# EAGLE design DR_EIB-128_Circle_0_25MM (EAGLE 9.1.1)
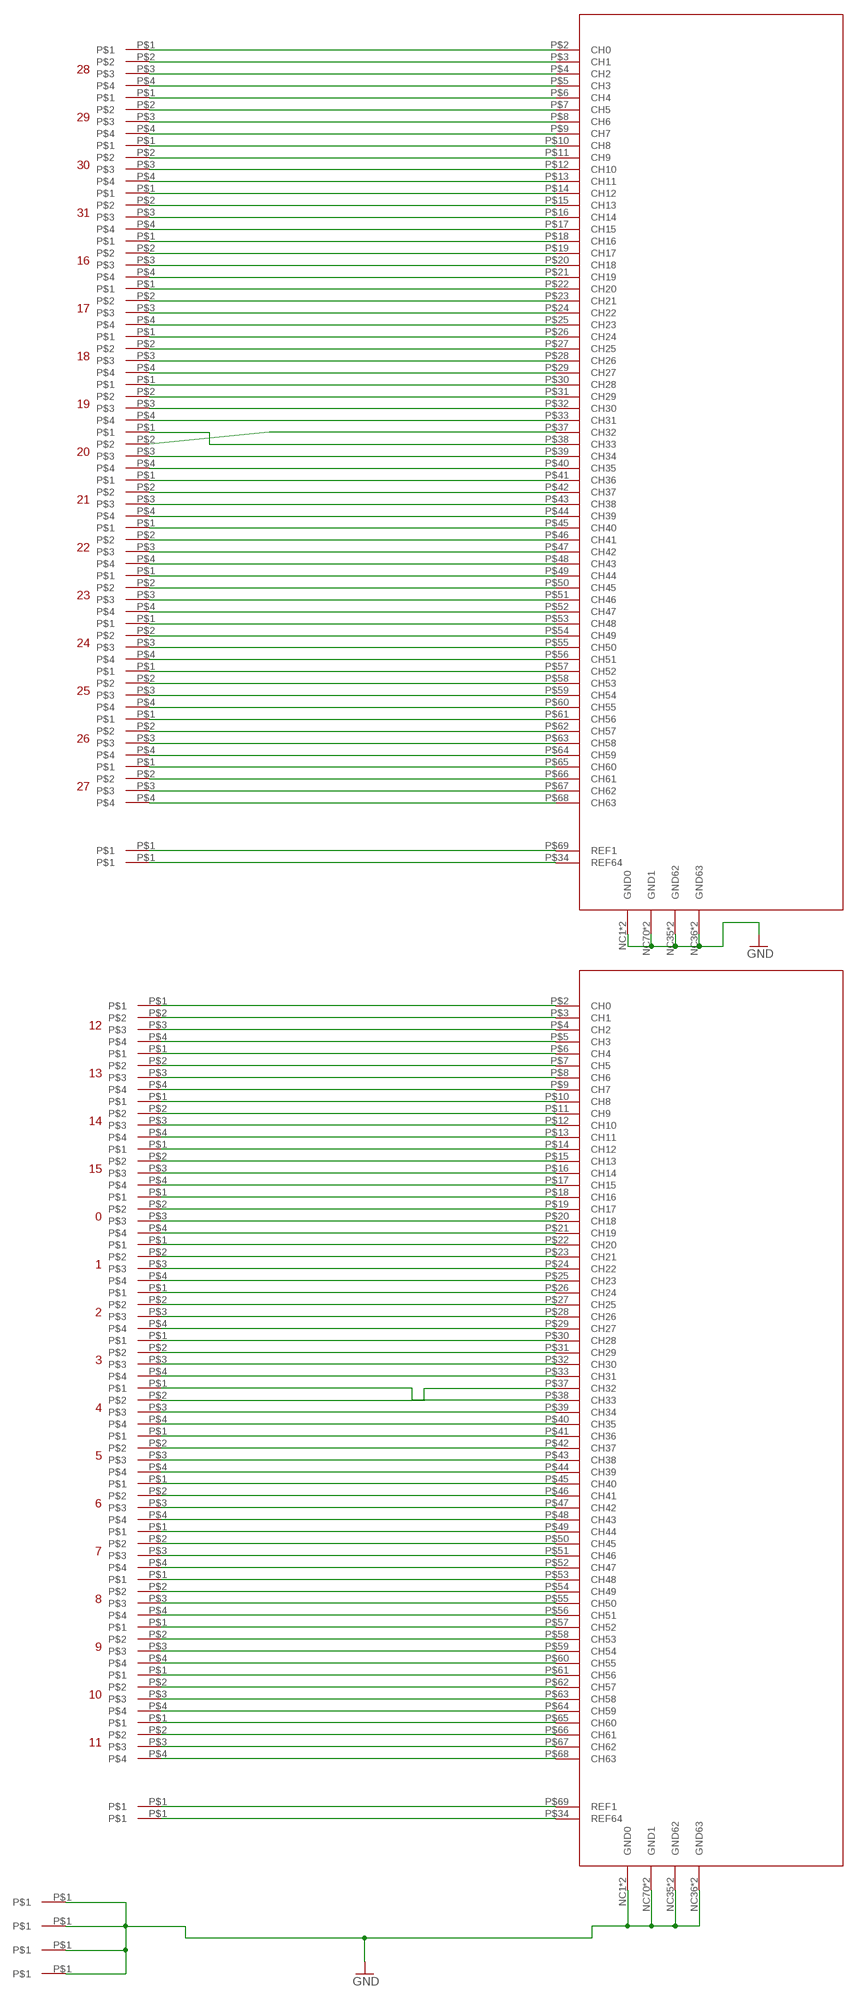
[diagram p0: schematic, sheet 1]

## Parts
0  TETRODE_1.5IN_RADIUS0.25MM  [TETRODE_1.5IN_RADIUS_0.25MM]
1  TETRODE_1.5IN_RADIUS0.25MM  [TETRODE_1.5IN_RADIUS_0.25MM]
2  TETRODE_1.5IN_RADIUS0.25MM  [TETRODE_1.5IN_RADIUS_0.25MM]
3  TETRODE_1.5IN_RADIUS0.25MM  [TETRODE_1.5IN_RADIUS_0.25MM]
4  TETRODE_1.5IN_RADIUS0.25MM  [TETRODE_1.5IN_RADIUS_0.25MM]
5  TETRODE_1.5IN_RADIUS0.25MM  [TETRODE_1.5IN_RADIUS_0.25MM]
6  TETRODE_1.5IN_RADIUS0.25MM  [TETRODE_1.5IN_RADIUS_0.25MM]
7  TETRODE_1.5IN_RADIUS0.25MM  [TETRODE_1.5IN_RADIUS_0.25MM]
8  TETRODE_1.5IN_RADIUS0.25MM  [TETRODE_1.5IN_RADIUS_0.25MM]
9  TETRODE_1.5IN_RADIUS0.25MM  [TETRODE_1.5IN_RADIUS_0.25MM]
10  TETRODE_1.5IN_RADIUS0.25MM  [TETRODE_1.5IN_RADIUS_0.25MM]
11  TETRODE_1.5IN_RADIUS0.25MM  [TETRODE_1.5IN_RADIUS_0.25MM]
12  TETRODE_1.5IN_RADIUS0.25MM  [TETRODE_1.5IN_RADIUS_0.25MM]
13  TETRODE_1.5IN_RADIUS0.25MM  [TETRODE_1.5IN_RADIUS_0.25MM]
14  TETRODE_1.5IN_RADIUS0.25MM  [TETRODE_1.5IN_RADIUS_0.25MM]
15  TETRODE_1.5IN_RADIUS0.25MM  [TETRODE_1.5IN_RADIUS_0.25MM]
16  TETRODE_1.5IN_RADIUS0.25MM  [TETRODE_1.5IN_RADIUS_0.25MM]
17  TETRODE_1.5IN_RADIUS0.25MM  [TETRODE_1.5IN_RADIUS_0.25MM]
18  TETRODE_1.5IN_RADIUS0.25MM  [TETRODE_1.5IN_RADIUS_0.25MM]
19  TETRODE_1.5IN_RADIUS0.25MM  [TETRODE_1.5IN_RADIUS_0.25MM]
20  TETRODE_1.5IN_RADIUS0.25MM  [TETRODE_1.5IN_RADIUS_0.25MM]
21  TETRODE_1.5IN_RADIUS0.25MM  [TETRODE_1.5IN_RADIUS_0.25MM]
22  TETRODE_1.5IN_RADIUS0.25MM  [TETRODE_1.5IN_RADIUS_0.25MM]
23  TETRODE_1.5IN_RADIUS0.25MM  [TETRODE_1.5IN_RADIUS_0.25MM]
24  TETRODE_1.5IN_RADIUS0.25MM  [TETRODE_1.5IN_RADIUS_0.25MM]
25  TETRODE_1.5IN_RADIUS0.25MM  [TETRODE_1.5IN_RADIUS_0.25MM]
26  TETRODE_1.5IN_RADIUS0.25MM  [TETRODE_1.5IN_RADIUS_0.25MM]
27  TETRODE_1.5IN_RADIUS0.25MM  [TETRODE_1.5IN_RADIUS_0.25MM]
28  TETRODE_1.5IN_RADIUS0.25MM  [TETRODE_1.5IN_RADIUS_0.25MM]
29  TETRODE_1.5IN_RADIUS0.25MM  [TETRODE_1.5IN_RADIUS_0.25MM]
30  TETRODE_1.5IN_RADIUS0.25MM  [TETRODE_1.5IN_RADIUS_0.25MM]
31  TETRODE_1.5IN_RADIUS0.25MM  [TETRODE_1.5IN_RADIUS_0.25MM]
U$1  TARRAYSHUTTLEHOLE  [TARRAYSHUTTLEHOLE]
U$2  TARRAYSHUTTLEHOLE  [TARRAYSHUTTLEHOLE]
U$4  TARRAYSHUTTLEHOLE  [TARRAYSHUTTLEHOLE]
U$5  TARRAYSHUTTLEHOLE  [TARRAYSHUTTLEHOLE]
U$6  TARRAYSHUTTLEHOLE  [TARRAYSHUTTLEHOLE]
U$7  TARRAYSHUTTLEHOLE  [TARRAYSHUTTLEHOLE]
U$8  TARRAYSHUTTLEHOLE  [TARRAYSHUTTLEHOLE]
U$9  TARRAYSHUTTLEHOLE  [TARRAYSHUTTLEHOLE]
U$10  HIROSE-70PIN-HEADER-SEQUENTIAL  [DF40C-70DP-0.4V]
U$11  HIROSE-70PIN-HEADER-SEQUENTIAL  [DF40C-70DP-0.4V]

## Nets
GND: U$1.P$1 U$2.P$1 U$4.P$1 U$5.P$1 U$10.NC1(GND0) U$10.NC35(GND62) U$10.NC36(GND63) U$10.NC70(GND1) U$10.P$1(GND0) U$10.P$35(GND62) U$10.P$36(GND63) U$10.P$70(GND1) U$11.NC1(GND0) U$11.NC35(GND62) U$11.NC36(GND63) U$11.NC70(GND1) U$11.P$1(GND0) U$11.P$35(GND62) U$11.P$36(GND63) U$11.P$70(GND1)
N$1: U$9.P$1 U$11.P$69(REF1)
N$2: U$8.P$1 U$11.P$34(REF64)
N$3: U$7.P$1 U$10.P$69(REF1)
N$4: U$6.P$1 U$10.P$34(REF64)
N$9: 4.P$1 U$11.P$38(CH33)
N$10: 4.P$2 U$11.P$37(CH32)
N$11: 16.P$1 U$10.P$18(CH16)
N$12: 16.P$2 U$10.P$19(CH17)
N$13: 16.P$3 U$10.P$20(CH18)
N$14: 16.P$4 U$10.P$21(CH19)
N$15: 17.P$1 U$10.P$22(CH20)
N$16: 17.P$2 U$10.P$23(CH21)
N$17: 17.P$3 U$10.P$24(CH22)
N$18: 17.P$4 U$10.P$25(CH23)
N$19: 18.P$1 U$10.P$26(CH24)
N$20: 18.P$2 U$10.P$27(CH25)
N$21: 18.P$3 U$10.P$28(CH26)
N$22: 18.P$4 U$10.P$29(CH27)
N$23: 19.P$1 U$10.P$30(CH28)
N$24: 19.P$2 U$10.P$31(CH29)
N$25: 19.P$3 U$10.P$32(CH30)
N$26: 19.P$4 U$10.P$33(CH31)
N$27: 20.P$1 U$10.P$38(CH33)
N$29: 20.P$3 U$10.P$39(CH34)
N$30: 20.P$4 U$10.P$40(CH35)
N$31: 21.P$1 U$10.P$41(CH36)
N$32: 21.P$2 U$10.P$42(CH37)
N$33: 21.P$3 U$10.P$43(CH38)
N$34: 21.P$4 U$10.P$44(CH39)
N$35: 22.P$1 U$10.P$45(CH40)
N$36: 22.P$2 U$10.P$46(CH41)
N$37: 22.P$3 U$10.P$47(CH42)
N$38: 22.P$4 U$10.P$48(CH43)
N$39: 23.P$1 U$10.P$49(CH44)
N$40: 23.P$2 U$10.P$50(CH45)
N$41: 23.P$3 U$10.P$51(CH46)
N$42: 23.P$4 U$10.P$52(CH47)
N$43: 24.P$1 U$10.P$53(CH48)
N$44: 24.P$2 U$10.P$54(CH49)
N$45: 24.P$3 U$10.P$55(CH50)
N$46: 24.P$4 U$10.P$56(CH51)
N$47: 25.P$1 U$10.P$57(CH52)
N$48: 25.P$2 U$10.P$58(CH53)
N$49: 25.P$3 U$10.P$59(CH54)
N$50: 25.P$4 U$10.P$60(CH55)
N$51: 26.P$1 U$10.P$61(CH56)
N$52: 26.P$2 U$10.P$62(CH57)
N$53: 26.P$3 U$10.P$63(CH58)
N$54: 26.P$4 U$10.P$64(CH59)
N$55: 28.P$1 U$10.P$2(CH0)
N$56: 28.P$2 U$10.P$3(CH1)
N$57: 28.P$3 U$10.P$4(CH2)
N$58: 28.P$4 U$10.P$5(CH3)
N$59: 29.P$1 U$10.P$6(CH4)
N$60: 29.P$2 U$10.P$7(CH5)
N$61: 29.P$3 U$10.P$8(CH6)
N$62: 29.P$4 U$10.P$9(CH7)
N$63: 30.P$1 U$10.P$10(CH8)
N$64: 30.P$2 U$10.P$11(CH9)
N$65: 30.P$3 U$10.P$12(CH10)
N$66: 30.P$4 U$10.P$13(CH11)
N$67: 31.P$1 U$10.P$14(CH12)
N$68: 31.P$2 U$10.P$15(CH13)
N$69: 31.P$3 U$10.P$16(CH14)
N$70: 31.P$4 U$10.P$17(CH15)
N$71: 27.P$1 U$10.P$65(CH60)
N$72: 27.P$2 U$10.P$66(CH61)
N$73: 27.P$3 U$10.P$67(CH62)
N$74: 27.P$4 U$10.P$68(CH63)
N$75: 20.P$2 U$10.P$37(CH32)
T6_1: 3.P$3 U$11.P$32(CH30)
T6_2: 3.P$1 U$11.P$30(CH28)
T6_3: 2.P$3 U$11.P$28(CH26)
T6_4: 2.P$1 U$11.P$26(CH24)
T7_1: 1.P$3 U$11.P$24(CH22)
T7_2: 1.P$1 U$11.P$22(CH20)
T7_3: 0.P$3 U$11.P$20(CH18)
T7_4: 0.P$1 U$11.P$18(CH16)
T8_1: 15.P$3 U$11.P$16(CH14)
T8_2: 15.P$1 U$11.P$14(CH12)
T8_3: 14.P$3 U$11.P$12(CH10)
T8_4: 14.P$1 U$11.P$10(CH8)
T9_1: 12.P$1 U$11.P$2(CH0)
T9_2: 12.P$3 U$11.P$4(CH2)
T9_3: 13.P$1 U$11.P$6(CH4)
T9_4: 13.P$3 U$11.P$8(CH6)
T10_1: 13.P$4 U$11.P$9(CH7)
T10_2: 13.P$2 U$11.P$7(CH5)
T10_3: 12.P$4 U$11.P$5(CH3)
T10_4: 12.P$2 U$11.P$3(CH1)
T11_1: 11.P$4 U$11.P$68(CH63)
T11_2: 11.P$2 U$11.P$66(CH61)
T11_3: 10.P$4 U$11.P$64(CH59)
T11_4: 10.P$2 U$11.P$62(CH57)
T12_1: 10.P$1 U$11.P$61(CH56)
T12_2: 10.P$3 U$11.P$63(CH58)
T12_3: 11.P$1 U$11.P$65(CH60)
T12_4: 11.P$3 U$11.P$67(CH62)
T13_1: 9.P$3 U$11.P$59(CH54)
T13_2: 9.P$1 U$11.P$57(CH52)
T13_3: 8.P$3 U$11.P$55(CH50)
T13_4: 8.P$1 U$11.P$53(CH48)
T14_1: 7.P$3 U$11.P$51(CH46)
T14_2: 7.P$1 U$11.P$49(CH44)
T14_3: 6.P$3 U$11.P$47(CH42)
T14_4: 6.P$1 U$11.P$45(CH40)
T15_1: 5.P$3 U$11.P$43(CH38)
T15_2: 5.P$1 U$11.P$41(CH36)
T15_3: 4.P$3 U$11.P$39(CH34)
T21_1: 14.P$2 U$11.P$11(CH9)
T21_2: 14.P$4 U$11.P$13(CH11)
T21_3: 15.P$2 U$11.P$15(CH13)
T21_4: 15.P$4 U$11.P$17(CH15)
T22_1: 0.P$2 U$11.P$19(CH17)
T22_2: 0.P$4 U$11.P$21(CH19)
T22_3: 1.P$2 U$11.P$23(CH21)
T22_4: 1.P$4 U$11.P$25(CH23)
T23_1: 2.P$2 U$11.P$27(CH25)
T23_2: 2.P$4 U$11.P$29(CH27)
T23_3: 3.P$2 U$11.P$31(CH29)
T23_4: 3.P$4 U$11.P$33(CH31)
T24_2: 4.P$4 U$11.P$40(CH35)
T24_3: 5.P$2 U$11.P$42(CH37)
T24_4: 5.P$4 U$11.P$44(CH39)
T25_1: 6.P$2 U$11.P$46(CH41)
T25_2: 6.P$4 U$11.P$48(CH43)
T25_3: 7.P$2 U$11.P$50(CH45)
T25_4: 7.P$4 U$11.P$52(CH47)
T26_1: 8.P$2 U$11.P$54(CH49)
T26_2: 8.P$4 U$11.P$56(CH51)
T26_3: 9.P$2 U$11.P$58(CH53)
T26_4: 9.P$4 U$11.P$60(CH55)

## Library data of the parts
0 1-31 = CactusPinInterfaces:TETRODE_1.5IN_RADIUS
U$1 U$2 U$4-U$9 = UsefulConnectors:TARRAYSHUTTLEHOLE
U$10 U$11 = UsefulConnectors:HIROSE-70PIN-HEADER

## Board
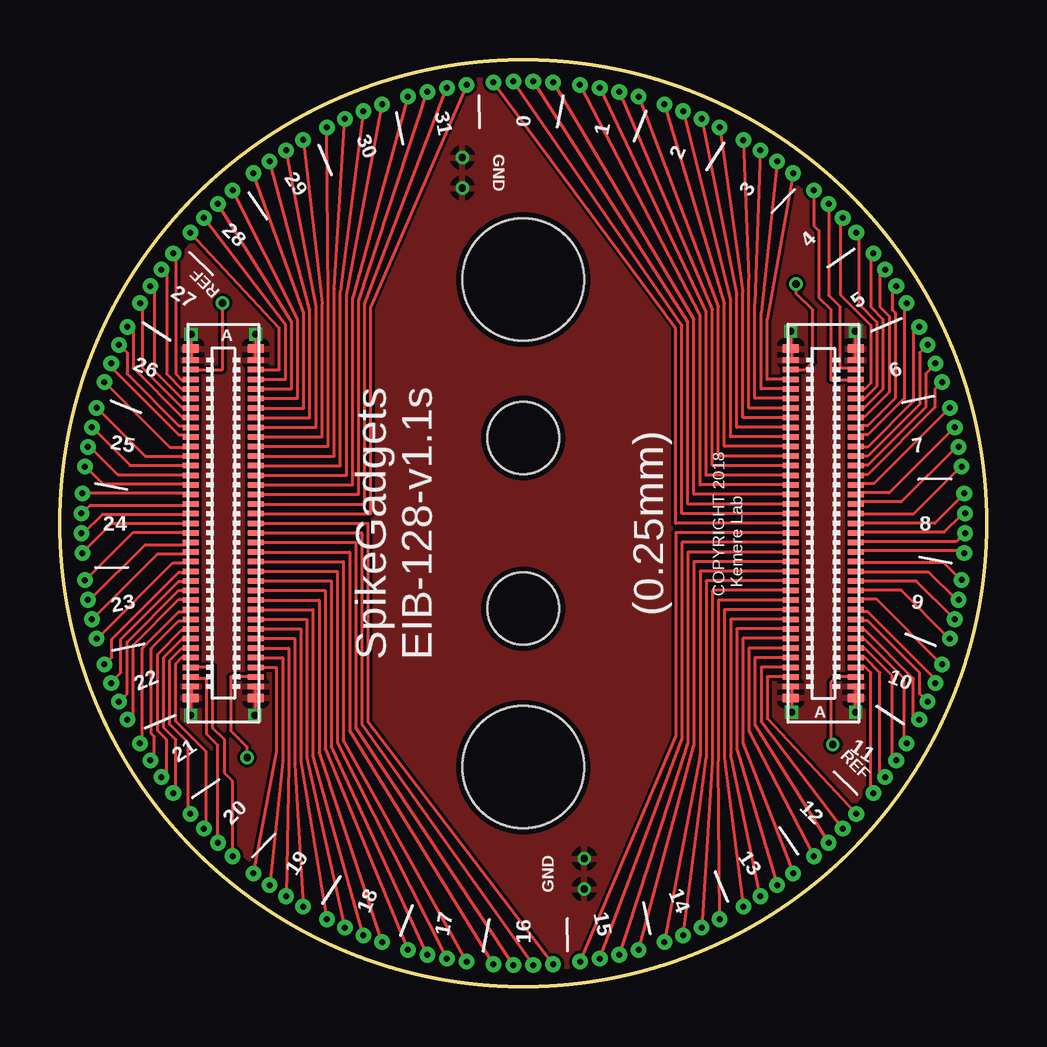
[diagram p1: board, top side]
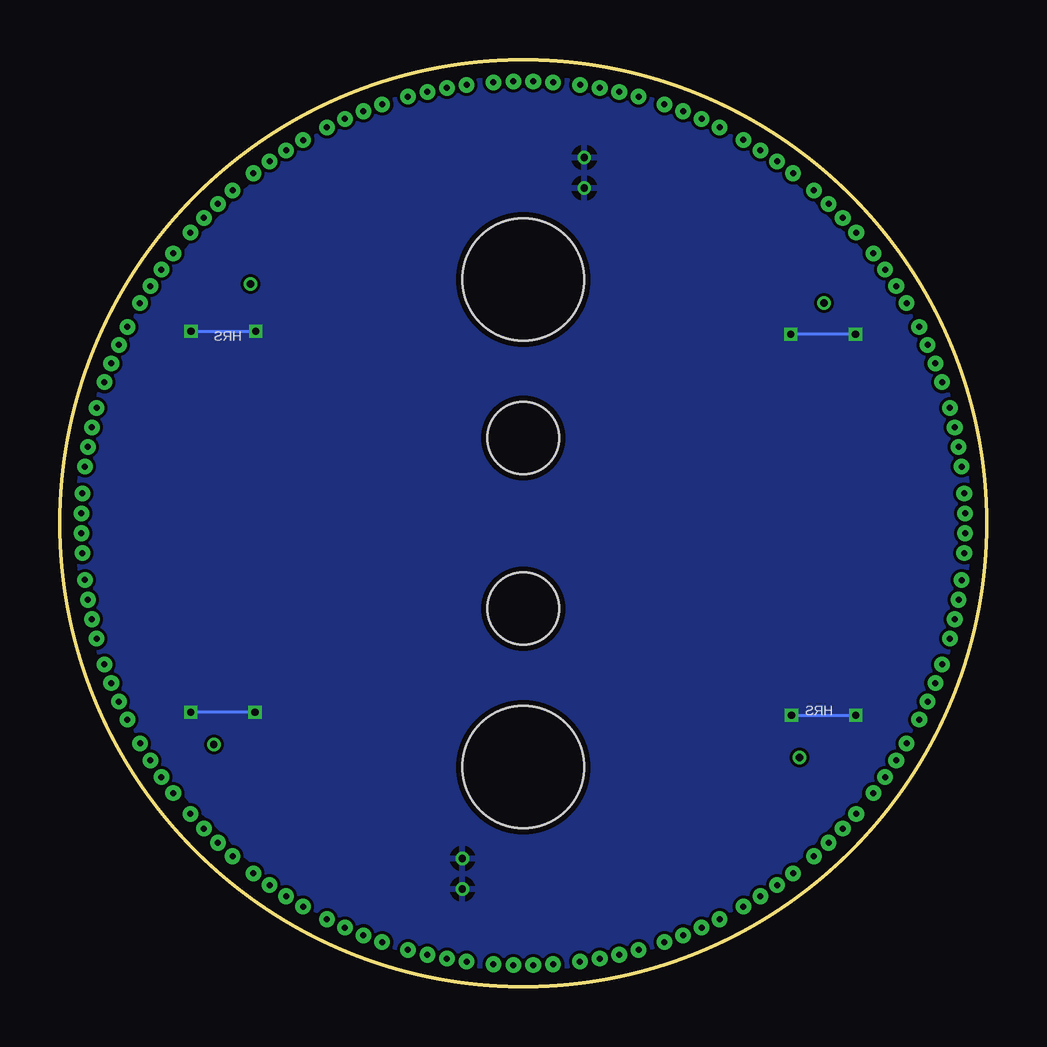
[diagram p2: board, bottom side, seen from below]

Size 38.61 x 38.61 mm. Coordinates in mm from the lower left corner, seen from the top.
Outline: circle at 19.3,19.3 radius 19.3
Copper layers (1*16): Top 0.035mm / dielectric 1.5mm / Bottom 0.035mm
Design rules "SeeedStudio_2layer_DRU_no_angle_20140221 *": minimum track width 5mil, minimum drill 0.25mm, track to track 5mil, track to pad 5mil, pad to pad 5mil, via to via 5mil, smd to smd 0mil, copper to edge 10mil, drill to drill 10mil, minimum pad ring 5mil, minimum via ring 5mil, stop-mask expansion 2mil, vias tented up to drill 100mil, thermal gap 10mil
Holes 3 mm at 19.3,15.75 19.3,22.86
Holes 5.08 mm at 19.3,29.46 19.3,9.14

### Footprints (pad centres in the part's own frame; a part is rotated, then mirrored left to right if it is on the bottom)
TETRODE_1.5IN_RADIUS_0.25MM = drill 0.25 pad 0.65: P$1 -1.246,-0.041; P$2 -0.416,-0.005; P$3 0.416,-0.005; P$4 1.246,-0.041
TARRAYSHUTTLEHOLE = drill 0.305: P$1 0,0
DF40C-70DP-0.4V = smd 0.35 x 0.66: NC1 -7.275,1.355; NC35 7.275,1.355; NC36 7.275,-1.355; NC70 -7.275,-1.355 | smd 0.23 x 0.66: P$1 -6.8,1.355; P$2 -6.4,1.355; P$3 -6,1.355; P$4 -5.6,1.355; P$5 -5.2,1.355; P$6 -4.8,1.355; P$7 -4.4,1.355; P$8 -4,1.355; P$9 -3.6,1.355; P$10 -3.2,1.355; P$11 -2.8,1.355; P$12 -2.4,1.355; P$13 -2,1.355; P$14 -1.6,1.355; P$15 -1.2,1.355; P$16 -0.8,1.355; P$17 -0.4,1.355; P$18 0,1.355; P$19 0.4,1.355; P$20 0.8,1.355; P$21 1.2,1.355; P$22 1.6,1.355; P$23 2,1.355; P$24 2.4,1.355; P$25 2.8,1.355; P$26 3.2,1.355; P$27 3.6,1.355; P$28 4,1.355; P$29 4.4,1.355; P$30 4.8,1.355; P$31 5.2,1.355; P$32 5.6,1.355; P$33 6,1.355; P$34 6.4,1.355; P$35 6.8,1.355; P$36 6.8,-1.355; P$37 6.4,-1.355; P$38 6,-1.355; P$39 5.6,-1.355; P$40 5.2,-1.355; P$41 4.8,-1.355; P$42 4.4,-1.355; P$43 4,-1.355; P$44 3.6,-1.355; P$45 3.2,-1.355; P$46 2.8,-1.355; P$47 2.4,-1.355; P$48 2,-1.355; P$49 1.6,-1.355; P$50 1.2,-1.355; P$51 0.8,-1.355; P$52 0.4,-1.355; P$53 0,-1.355; P$54 -0.4,-1.355; P$55 -0.8,-1.355; P$56 -1.2,-1.355; P$57 -1.6,-1.355; P$58 -2,-1.355; P$59 -2.4,-1.355; P$60 -2.8,-1.355; P$61 -3.2,-1.355; P$62 -3.6,-1.355; P$63 -4,-1.355; P$64 -4.4,-1.355; P$65 -4.8,-1.355; P$66 -5.2,-1.355; P$67 -5.6,-1.355; P$68 -6,-1.355; P$69 -6.4,-1.355; P$70 -6.8,-1.355

### Placement (x,y rotation side)
0  19.3,37.72 0 top
1  22.9,37.37 348.8 top
2  26.35,36.32 337.5 top
3  29.53,34.62 326.3 top
4  32.33,32.33 315 top
5  34.62,29.53 303.8 top
6  36.32,26.35 292.5 top
7  37.37,22.9 281.3 top
8  37.72,19.3 270 top
9  37.37,15.71 258.8 top
10  36.32,12.26 247.5 top
11  34.62,9.07 236.3 top
12  32.33,6.28 225 top
13  29.53,3.99 213.8 top
14  26.35,2.29 202.5 top
15  22.9,1.24 191.3 top
16  19.3,0.89 180 top
17  15.71,1.24 168.8 top
18  12.26,2.29 157.5 top
19  9.07,3.99 146.3 top
20  6.28,6.28 135 top
21  3.99,9.07 123.8 top
22  2.29,12.26 112.5 top
23  1.24,15.71 101.3 top
24  0.89,19.3 90 top
25  1.24,22.9 78.8 top
26  2.29,26.35 67.5 top
27  3.99,29.53 56.3 top
28  6.28,32.33 45 top
29  9.07,34.62 33.8 top
30  12.26,36.32 22.5 top
31  15.71,37.37 11.3 top
U$1  21.84,4.06 135 top
U$2  21.84,5.33 135 top
U$4  16.76,34.54 135 top
U$5  16.76,33.27 135 top
U$6  7.8,9.55 135 top
U$7  6.77,28.48 135 top
U$8  30.67,29.28 315 top
U$9  32.2,10.09 315 top
U$10  6.8,19.3 270 top
U$11  31.8,19.3 90 top

### Tracks (layer width: path | path; a pad name or v marks a point on that pad's centre or on a via)
GND  (via drill 0.3)
  Top 0.127: U$10.P$1 8.13,26.16 8.13,26.54 U$10.NC1 v8.16,27.18 | U$10.P$70 5.46,26.16 5.46,26.54 U$10.NC70 v5.46,27.18 | U$10.P$35 8.13,12.45 8.13,12.06 U$10.NC35 8.13,12.03 v8.13,11.3 | U$10.P$36 5.46,12.45 5.46,12.06 U$10.NC36 v5.45,11.3 | U$11.NC36 33.15,26.54 33.15,26.16 U$11.P$36 v33.15,27.3 | U$11.P$35 30.48,26.16 30.48,26.54 U$11.NC35 v30.45,27.3 | U$11.P$70 33.15,12.45 33.15,12.06 U$11.NC70 v33.16,11.43 | 30.48,12.06 30.48,12.45 U$11.P$1 | 30.48,12.06 U$11.NC1 | 30.48,12.06 v30.48,11.43
  Bottom 0.127: v5.46,27.18 v8.16,27.18 | v8.13,11.3 v5.45,11.3 | v30.48,11.43 v33.16,11.43 | v33.15,27.3 v30.45,27.3
  pour Bottom: 6.6,6.6 arc100 32,6.6 arc100 32,32 arc100 6.6,32 arc100
  pour Top: 6.6,6.6 arc100 32,6.6 arc100 32,32 arc100 6.6,32 arc100
N$1
  Top 0.127: U$11.P$69 32.33,12.9 32.13,12.7 32.13,10.09 U$9.P$1
N$2
  Top 0.127: U$11.P$34 31.04,25.7 31.37,26.04 31.37,28.19 30.67,28.9 U$8.P$1
N$3
  Top 0.127: U$10.P$69 6.77,25.7 U$7.P$1
N$4
  Top 0.127: U$10.P$34 7.11,12.9 7.11,10.67 7.8,9.98 U$6.P$1
N$9
  Top 0.127: U$11.P$38 33.15,25.27 32.13,25.27 32.13,28.19 31.62,28.7 31.62,31.5 31.42,31.7 4.P$1
N$10
  Top 0.127: U$11.P$37 33.15,25.78 32.51,25.78 32.51,28.32 32.03,28.8 4.P$2
N$11
  Top 0.127: U$10.P$18 12.83,19.3 12.83,11.05 16.P$1
N$12
  Top 0.127: U$10.P$19 12.57,18.9 12.57,10.92 16.P$2
N$13
  Top 0.127: U$10.P$20 12.32,18.5 12.32,10.79 16.P$3
N$14
  Top 0.127: U$10.P$21 12.06,18.1 12.06,10.67 16.P$4
N$15
  Top 0.127: U$10.P$22 11.81,17.7 11.81,10.29 17.P$1
N$16
  Top 0.127: U$10.P$23 11.56,17.3 11.56,10.16 17.P$2
N$17
  Top 0.127: U$10.P$24 11.3,16.9 11.3,10.03 17.P$3
N$18
  Top 0.127: U$10.P$25 11.05,16.5 11.05,9.91 17.P$4
N$19
  Top 0.127: U$10.P$26 10.79,16.1 10.79,9.78 18.P$1
N$20
  Top 0.127: U$10.P$27 10.54,15.7 10.54,9.65 18.P$2
N$21
  Top 0.127: U$10.P$28 10.29,15.3 10.29,9.52 18.P$3
N$22
  Top 0.127: U$10.P$29 10.03,14.9 10.03,9.4 18.P$4
N$23
  Top 0.127: U$10.P$30 9.78,14.5 9.78,9.27 19.P$1
N$24
  Top 0.127: U$10.P$31 9.52,14.1 9.52,9.27 19.P$2
N$25
  Top 0.127: U$10.P$32 9.27,13.7 9.27,9.4 19.P$3
N$26
  Top 0.127: U$10.P$33 9.02,13.3 9.02,9.78 19.P$4
N$27
  Top 0.127: U$10.P$38 5.46,13.33 6.35,13.33 6.35,10.79 6.86,10.29 6.86,8.89 7.19,8.56 20.P$1
N$29
  Top 0.127: U$10.P$39 5.33,13.72 5.08,13.72 4.83,13.46 4.83,11.05 6.1,9.78 6.1,6.6 20.P$3
N$30
  Top 0.127: U$10.P$40 5.33,14.1 5.08,14.1 4.57,13.59 4.57,10.92 5.33,10.16 5.33,7.24 20.P$4
N$31
  Top 0.127: U$10.P$41 5.33,14.48 5.08,14.48 4.32,13.72 4.32,10.79 4.83,10.29 4.83,8.13 21.P$1
N$32
  Top 0.127: U$10.P$42 5.33,14.86 5.08,14.86 4.06,13.84 4.06,10.67 4.44,10.29 4.44,8.89 4.32,8.76 21.P$2
N$33
  Top 0.127: U$10.P$43 5.33,15.24 4.95,15.24 3.81,14.1 3.81,10.54 3.94,10.41 3.94,9.65 3.81,9.52 21.P$3
N$34
  Top 0.127: U$10.P$44 5.33,15.62 4.95,15.62 3.43,14.1 3.43,10.16 21.P$4
N$35
  Top 0.127: U$10.P$45 5.33,16.13 4.95,16.13 3.05,14.22 3.05,11.3 2.92,11.18 22.P$1
N$36
  Top 0.127: U$10.P$46 5.33,16.51 4.95,16.51 2.79,14.35 2.79,12.19 2.54,11.94 22.P$2
N$37
  Top 0.127: U$10.P$47 5.33,16.89 4.95,16.89 2.54,14.48 2.54,13.08 2.16,12.7 22.P$3
N$38
  Top 0.127: U$10.P$48 5.33,17.27 4.95,17.27 2.16,14.48 2.16,13.72 1.9,13.46 22.P$4
N$39
  Top 0.127: U$10.P$49 5.33,17.65 4.7,17.65 1.65,14.61 23.P$1
N$40
  Top 0.127: U$10.P$50 5.33,18.03 4.06,18.03 1.4,15.37 23.P$2
N$41
  Top 0.127: U$10.P$51 5.33,18.41 3.56,18.41 1.27,16.13 23.P$3
N$42
  Top 0.127: U$10.P$52 5.33,18.92 3.05,18.92 1.14,17.02 23.P$4
N$43
  Top 0.127: U$10.P$53 2.16,19.3 1.02,18.16 24.P$1
N$44
  Top 0.127: U$10.P$54 5.33,19.68 1.78,19.68 1.02,18.92 24.P$2
N$45
  Top 0.127: U$10.P$55 5.33,20.07 1.27,20.07 1.02,19.81 24.P$3
N$46
  Top 0.127: U$10.P$56 5.33,20.57 1.02,20.57 24.P$4
N$47
  Top 0.127: U$10.P$57 5.33,20.95 1.78,20.95 1.14,21.59 25.P$1
N$48
  Top 0.127: U$10.P$58 5.33,21.34 2.41,21.34 1.27,22.48 25.P$2
N$49
  Top 0.127: U$10.P$59 5.33,21.72 2.92,21.72 1.4,23.24 25.P$3
N$50
  Top 0.127: U$10.P$60 5.33,22.1 3.56,22.1 1.65,24 25.P$4
N$51
  Top 0.127: U$10.P$61 5.33,22.48 4.57,22.48 1.9,25.15 26.P$1
N$52
  Top 0.127: U$10.P$62 5.33,22.99 4.95,22.99 2.03,25.91 26.P$2
N$53
  Top 0.127: U$10.P$63 5.33,23.37 4.95,23.37 2.79,25.53 2.79,26.42 2.54,26.67 26.P$3
N$54
  Top 0.127: U$10.P$64 5.33,23.75 5.08,23.75 3.05,25.78 3.05,27.3 2.92,27.43 26.P$4
N$55
  Top 0.127: U$10.P$2 9.14,25.7 9.14,27.43 28.P$1
N$56
  Top 0.127: U$10.P$3 9.4,25.3 9.4,27.56 28.P$2
N$57
  Top 0.127: U$10.P$4 9.65,24.9 9.65,27.69 28.P$3
N$58
  Top 0.127: U$10.P$5 9.91,24.5 9.91,27.81 28.P$4
N$59
  Top 0.127: U$10.P$6 10.16,24.1 10.16,28.07 29.P$1
N$60
  Top 0.127: U$10.P$7 10.41,23.7 10.41,28.19 29.P$2
N$61
  Top 0.127: U$10.P$8 10.67,23.3 10.67,28.32 29.P$3
N$62
  Top 0.127: U$10.P$9 10.92,22.9 10.92,28.45 29.P$4
N$63
  Top 0.127: U$10.P$10 11.18,22.5 11.18,28.7 30.P$1
N$64
  Top 0.127: U$10.P$11 11.43,22.1 11.43,29.08 30.P$2
N$65
  Top 0.127: U$10.P$12 11.68,21.7 11.68,28.96 30.P$3
N$66
  Top 0.127: U$10.P$13 11.94,21.3 11.94,28.83 30.P$4
N$67
  Top 0.127: U$10.P$14 12.19,20.9 12.19,28.7 31.P$1
N$68
  Top 0.127: U$10.P$15 12.45,20.5 12.45,28.57 31.P$2
N$69
  Top 0.127: U$10.P$16 12.7,20.1 12.7,28.45 31.P$3
N$70
  Top 0.127: U$10.P$17 12.95,19.7 12.95,28.32 31.P$4
N$71
  Top 0.127: U$10.P$65 5.33,24.13 5.08,24.13 3.43,25.78 3.43,28.45 27.P$1
N$72
  Top 0.127: U$10.P$66 5.33,24.51 5.08,24.51 3.94,25.65 3.94,28.96 3.81,29.08 27.P$2
N$73
  Top 0.127: U$10.P$67 5.33,24.89 5.08,24.89 4.44,25.53 4.44,29.72 4.32,29.84 27.P$3
N$74
  Top 0.127: U$10.P$68 5.33,25.27 5.08,25.27 4.83,25.53 4.83,30.48 27.P$4
N$75
  Top 0.127: U$10.P$37 5.46,12.83 6.1,12.83 6.1,10.54 6.58,10.06 20.P$2
T6_1
  Top 0.127: U$11.P$32 29.21,24.9 29.21,28.07 3.P$3
T6_2
  Top 0.127: U$11.P$30 28.7,24.1 28.7,29.46 3.P$1
T6_3
  Top 0.127: U$11.P$28 28.19,23.3 28.19,28.83 2.P$3
T6_4
  Top 0.127: U$11.P$26 27.69,22.5 27.69,28.45 2.P$1
T7_1
  Top 0.127: U$11.P$24 27.18,21.7 27.18,28.19 1.P$3
T7_2
  Top 0.127: U$11.P$22 26.67,20.9 26.67,27.94 1.P$1
T7_3
  Top 0.127: U$11.P$20 26.16,20.1 26.16,27.69 0.P$3
T7_4
  Top 0.127: U$11.P$18 25.65,19.3 25.65,27.43 0.P$1
T8_1
  Top 0.127: U$11.P$16 25.91,18.5 25.91,10.29 15.P$3
T8_2
  Top 0.127: U$11.P$14 26.42,17.7 26.42,10.03 15.P$1
T8_3
  Top 0.127: U$11.P$12 26.92,16.9 26.92,9.52 14.P$3
T8_4
  Top 0.127: U$11.P$10 27.43,16.1 27.43,9.4 14.P$1
T9_1
  Top 0.127: U$11.P$2 29.46,12.9 29.46,11.18 12.P$1
T9_2
  Top 0.127: U$11.P$4 28.96,13.7 28.96,10.92 12.P$3
T9_3
  Top 0.127: U$11.P$6 28.45,14.5 28.45,10.16 13.P$1
T9_4
  Top 0.127: U$11.P$8 27.94,15.3 27.94,9.65 13.P$3
T10_1
  Top 0.127: U$11.P$9 27.69,15.7 27.69,9.52 13.P$4
T10_2
  Top 0.127: U$11.P$7 28.19,14.9 28.19,9.91 13.P$2
T10_3
  Top 0.127: U$11.P$5 28.7,14.1 28.7,10.67 12.P$4
T10_4
  Top 0.127: U$11.P$3 29.21,13.3 29.21,11.05 12.P$2
T11_1
  Top 0.127: U$11.P$68 33.27,13.33 33.53,13.33 33.78,13.08 33.78,8.13 11.P$4
T11_2
  Top 0.127: U$11.P$66 33.27,14.1 33.53,14.1 34.67,12.95 34.67,9.65 34.8,9.52 11.P$2
T11_3
  Top 0.127: U$11.P$64 33.27,14.86 33.53,14.86 35.56,12.83 35.56,11.3 35.69,11.18 10.P$4
T11_4
  Top 0.127: U$11.P$62 33.27,15.62 33.66,15.62 36.58,12.7 10.P$2
T12_1
  Top 0.127: U$11.P$61 33.27,16.13 34.04,16.13 36.7,13.46 10.P$1
T12_2
  Top 0.127: U$11.P$63 33.27,15.24 33.66,15.24 35.81,13.08 35.81,12.19 36.07,11.94 10.P$3
T12_3
  Top 0.127: U$11.P$65 33.27,14.48 33.53,14.48 35.18,12.83 35.18,10.16 11.P$1
T12_4
  Top 0.127: U$11.P$67 33.27,13.72 33.53,13.72 34.16,13.08 34.16,8.89 34.29,8.76 11.P$3
T13_1
  Top 0.127: U$11.P$59 33.27,16.89 35.69,16.89 37.21,15.37 9.P$3
T13_2
  Top 0.127: U$11.P$57 33.27,17.65 36.83,17.65 37.47,17.02 9.P$1
T13_3
  Top 0.127: U$11.P$55 33.27,18.54 37.34,18.54 37.59,18.8 8.P$3
T13_4
  Top 0.127: U$11.P$53 36.45,19.3 37.59,20.45 8.P$1
T14_1
  Top 0.127: U$11.P$51 33.27,20.19 35.05,20.19 37.34,22.48 7.P$3
T14_2
  Top 0.127: U$11.P$49 33.27,20.95 33.91,20.95 36.96,24 7.P$1
T14_3
  Top 0.127: U$11.P$47 33.27,21.72 33.66,21.72 36.07,24.13 36.07,25.53 36.45,25.91 6.P$3
T14_4
  Top 0.127: U$11.P$45 33.27,22.48 33.66,22.48 35.56,24.38 35.56,27.3 35.69,27.43 6.P$1
T15_1
  Top 0.127: U$11.P$43 33.27,23.37 33.66,23.37 34.8,24.51 34.8,28.07 34.67,28.19 34.67,28.96 34.8,29.08 5.P$3
T15_2
  Top 0.127: U$11.P$41 33.27,24.13 33.53,24.13 34.29,24.89 34.29,27.81 33.78,28.32 33.78,30.48 5.P$1
T15_3
  Top 0.127: U$11.P$39 33.27,24.89 33.53,24.89 33.78,25.15 33.78,27.56 32.51,28.83 32.51,32 4.P$3
T21_1
  Top 0.127: U$11.P$11 27.18,16.5 27.18,9.4 14.P$2
T21_2
  Top 0.127: U$11.P$13 26.67,17.3 26.67,9.65 14.P$4
T21_3
  Top 0.127: U$11.P$15 26.16,18.1 26.16,10.16 15.P$2
T21_4
  Top 0.127: U$11.P$17 25.65,18.9 25.65,10.41 15.P$4
T22_1
  Top 0.127: U$11.P$19 25.91,19.7 25.91,27.56 0.P$2
T22_2
  Top 0.127: U$11.P$21 26.42,20.5 26.42,27.81 0.P$4
T22_3
  Top 0.127: U$11.P$23 26.92,21.3 26.92,28.07 1.P$2
T22_4
  Top 0.127: U$11.P$25 27.43,22.1 27.43,28.32 1.P$4
T23_1
  Top 0.127: U$11.P$27 27.94,22.9 27.94,28.57 2.P$2
T23_2
  Top 0.127: U$11.P$29 28.45,23.7 28.45,28.96 2.P$4
T23_3
  Top 0.127: U$11.P$31 28.96,24.5 28.96,28.45 3.P$2
T23_4
  Top 0.127: U$11.P$33 29.46,25.3 29.46,27.81 3.P$4
T24_2
  Top 0.127: U$11.P$40 33.27,24.51 33.53,24.51 34.04,25.02 34.04,27.69 33.27,28.45 33.27,31.37 4.P$4
T24_3
  Top 0.127: U$11.P$42 33.27,23.75 33.53,23.75 34.54,24.76 34.54,27.94 34.16,28.32 34.16,29.72 34.29,29.84 5.P$2
T24_4
  Top 0.127: U$11.P$44 33.27,22.99 33.66,22.99 35.18,24.51 35.18,28.45 5.P$4
T25_1
  Top 0.127: U$11.P$46 33.27,22.1 33.66,22.1 35.81,24.26 35.81,26.42 36.07,26.67 6.P$2
T25_2
  Top 0.127: U$11.P$48 33.27,21.34 33.66,21.34 36.45,24.13 36.45,24.89 36.7,25.15 6.P$4
T25_3
  Top 0.127: U$11.P$50 33.27,20.57 34.54,20.57 37.21,23.24 7.P$2
T25_4
  Top 0.127: U$11.P$52 33.27,19.68 35.56,19.68 37.47,21.59 7.P$4
T26_1
  Top 0.127: U$11.P$54 33.27,18.92 36.83,18.92 37.59,19.68 8.P$2
T26_2
  Top 0.127: U$11.P$56 33.27,18.16 37.59,18.16 8.P$4
T26_3
  Top 0.127: U$11.P$58 33.27,17.27 36.19,17.27 37.34,16.13 9.P$2
T26_4
  Top 0.127: U$11.P$60 33.27,16.51 35.05,16.51 36.96,14.61 9.P$4

### Text on the board
tPlace: GND | REF | SpikeGadgets / EIB-128-v1.1s | (0.25mm) | COPYRIGHT 2018 / Kemere Lab | REF | GND